# Altium schematic sheet 原理图.SchDoc
size A4
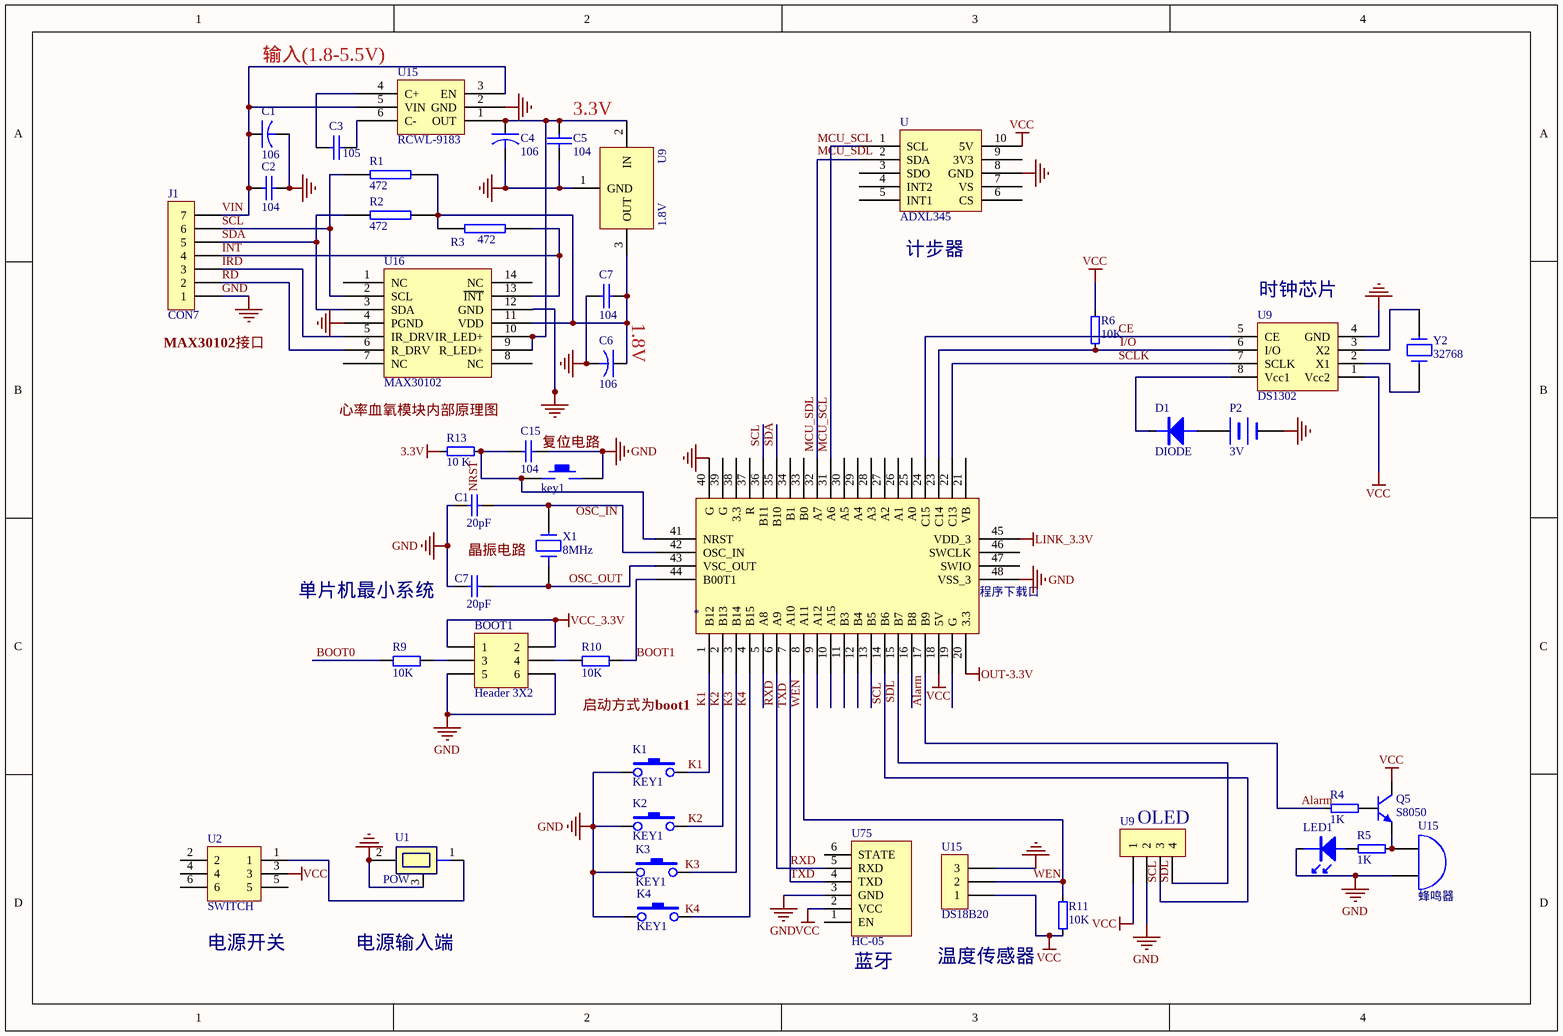
[diagram p0: 原理图.SchDoc]

## Parts
(Parts that share a designator on the sheet are numbered #1, #2 ... from top to bottom, then left to right.)
*  程序下载口
BOOT1  Header 3X2  [排针2X3]
C1#1  106
C1#2  20pF  [0603C]
C2  104
C3  105
C4  106
C5  104
C6  106
C7#1  104
C7#2  20pF  [0603C]
C15  104  [0603C]
D1  DIODE  [IN4148]
J1  CON7
K1  KEY1  [KEY1]
K2  KEY1  [KEY1]
K3  KEY1  [KEY1]
K4  KEY1  [KEY1]
key1  KEY_M  [按键]  (value not drawn)
LED1  (no value)  [LED]
P2  3V  [BATTERY]
Q5  S8050  [PNP]
R1  472
R2  472
R3  472
R4  1K  [R-DIP]
R5  1K  [R-DIP]
R6  10K  [R-DIP]
R9  10K  [0603R]
R10  10K  [0603R]
R11  10K  [R-DIP]
R13  10 K  [R-DIP]
U  ADXL345  [ADXL345]
U1  POW  [DCM]
U2  SWITCH  [KG1]
U9#1  1.8V  [TO220H]
U9#2  DS1302  [DIP8]
U9#3  (no value)  [SIP4]
U15#1  RCWL-9183
U15#2  蜂鸣器  [BEEP]
U15#3  DS18B20  [SIP3]
U16  MAX30102
U75  HC-05  [SIP6]
X1  8MHz  [晶振8M]
Y2  32768  [SIP2]

## Nets
3.3V: R13.1
GND: *.40(G) *.48(VSS_3) BOOT1.5 BOOT1.6 C1#1.2 C1#2.1 C2.1 C4.2 C5.1 C6.2 C7#1.1 C7#2.1 C15.1 J1.1 K1.1 K2.1 K3.1 K4.1 key1.2 LED1.2 P2.2(-) U.8(GND) U1.2 U1.3 U9#1.1(GND) U9#2.4(GND) U9#3.2 U15#1.2(GND) U15#2.2(B) U15#3.3 U16.4(PGND) U16.12(GND) U75.3(GND)
LINK_3.3V: *.45(VDD_3)
OUT-3.3V: *.20(3.3)
VCC: *.18(5V) Q5.3(C) R6.1 R11.1 U.10(5V) U2.3 U9#2.1(Vcc2) U9#3.1 U15#3.1 U75.2(VCC)
VCC_3.3V: BOOT1.1 BOOT1.2
Alarm: *.17(B9) R4.1
BOOT0: R9.1
BOOT1: *.44(B00T1) R10.2
CE: *.24(C15) U9#2.5(CE)
I/O: *.23(C14) R6.2 U9#2.6(I/O)
INT: J1.4 R3.2 U16.13(~{INT})
IRD: J1.3 U16.5(IR_DRV)
K1: *.1(B12) K1.2
K2: *.2(B13) K2.2
K3: *.3(B14) K3.2
K4: *.4(B15) K4.2
MCU_SCL: *.31(A6) U.1(SCL)
MCU_SDL: *.32(A7) U.2(SDA)
OSC_OUT: *.43(VSC_OUT) C7#2.2 X1.1
RD: J1.2 U16.6(R_DRV)
RXD: *.6(A9) *.7(A10) U75.4(TXD) U75.5(RXD)  [also labelled TXD]
SCL: *.14(B6) *.36(B11) J1.6 R1.2 U9#3.3 U16.2(SCL)
SCLK: *.22(C13) U9#2.7(SCLK)
SDA: *.35(B10) J1.5 R2.2 U16.3(SDA)
SDL: *.15(B7) U9#3.4
VIN: C1#1.1 C2.2 J1.7 U15#1.3(EN) U15#1.5(VIN)
WEN: *.8(A11) R11.2 U15#3.2
Net*_41: *.41(NRST) C15.2 key1.1 R13.2
Net*_42: *.42(OSC_IN) C1#2.2 X1.2
NetBOOT1_3: BOOT1.3 R9.2
NetBOOT1_4: BOOT1.4 R10.1
NetC3_1: C3.1 U15#1.4(C+)
NetC3_2: C3.2 U15#1.6(C-)
NetC4_1: C4.1 C5.2 U9#1.2(IN) U15#1.1(OUT) U16.9(R_LED+) U16.10(IR_LED+)
NetC6_1: C6.1 C7#1.2 R1.1 R2.1 R3.1 U9#1.3(OUT) U16.11(VDD)
NetD1_1: D1.1(A) P2.1(+)
NetD1_2: D1.2(K) U9#2.8(Vcc1)
NetLED1_1: LED1.1 R5.1
NetQ5_1: Q5.1(B) R4.2
NetQ5_2: Q5.2(E) R5.2 U15#2.1(A)
NetU1_1: U1.1 U2.1
NetU9#2_2: U9#2.2(X1) Y2.1
NetU9#2_3: U9#2.3(X2) Y2.2

Not connected (* = marked no-connect by the designer): * 5(A8) 9(A12) 10(A15) 11(B3) 12(B4) 13(B5) 16(B8) 19(G) 21(VB) 25(A0) 26(A1) 27(A2) 28(A3) 29(A4) 30(A5) 33(B0) 34(B1) 37(R) 38(3.3) 39(G) 46(SWCLK) 47(SWIO); U 3(SDO) 4(INT2) 5(INT1) 6(CS) 7(VS) 9(3V3); U2 2 4 5 6; U16 1(NC) 7(NC) 8(NC) 14(NC); U75 1(EN) 6(STATE)

## Notes on the sheet
- (near U15#1) 输入(1.8-5.5V)
- 3.3V
- (near U) 计步器
- (near U9#2) 时钟芯片
- (near C6) 1.8V
- 单片机最小系统
- (near U9#3) OLED
- (near U2) 电源开关
- 电源输入端
- (near U75) 蓝牙
- 温度传感器
- Labels drawn without touching a wire or pin: K3, K4, MAX30102接口, MCU_SCL, MCU_SDL, NRST, OSC_IN, 启动方式为boot1, 复位电路, 心率血氧模块内部原理图, 晶振电路

## Library data of the parts
* = STM32F103C8T6-2
BOOT1 = Header 3X2: Header, 3-Pin, Dual row; LatestRevisionDate: 17-Jul-2002; LatestRevisionNote: Re-released for DXP Platform.; Publisher: Altium Limited
C1#1 C4 C6 = CAPACITOR
C1#2 C7#2 C15 = Cap: Capacitor; Value: 10nF; Published: 8-Jun-2000; Revision: July-2002: Re-released for DXP Platform.; Publisher: Altium Limited
C2 C3 C5 C7#1 = CAP: Capacitor
J1 = CON7: Connector
LED1 = LED
P2 = BATTERY
Q5 = NPN
R1-R3 = RES2
R6 R13 = 1K
R9 R10 = R
U9#1 = VOLTREG
U9#3 = CON4
U15#2 = BELL
U15#3 = CON3
U16 = MAX30100
X1 Y2 = CRYSTAL